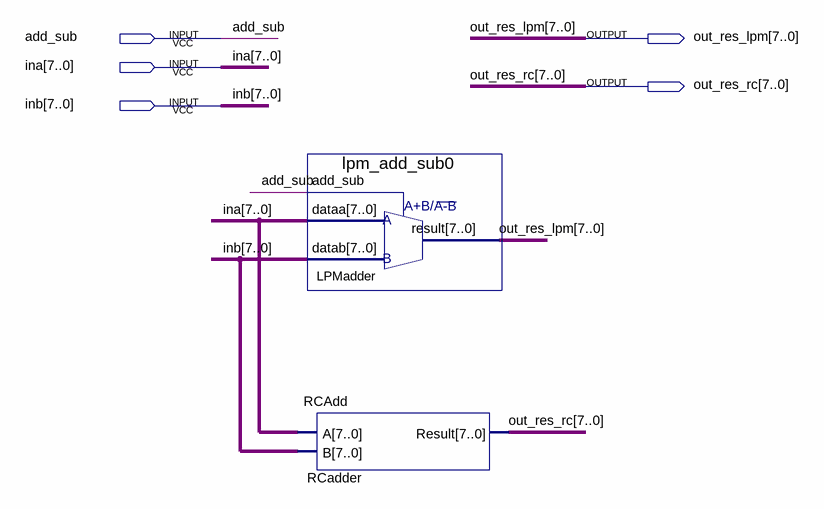
[diagram p0: schematic sheet]
// Quartus schematic adder_lpm_rc.bdf as structural Verilog: 2 symbols, 5 pins
module adder_lpm_rc (
  input  add_sub,
  input  [7:0] ina,
  input  [7:0] inb,
  output [7:0] out_res_lpm,
  output [7:0] out_res_rc
);

  lpm_add_sub0 LPMadder (.add_sub(add_sub), .dataa(ina), .datab(inb), .result(out_res_lpm));
  RCAdd RCadder (.A(ina), .B(inb), .Result(out_res_rc));
endmodule
